# Altium schematic sheet LaserInterface.SchDoc
size A3
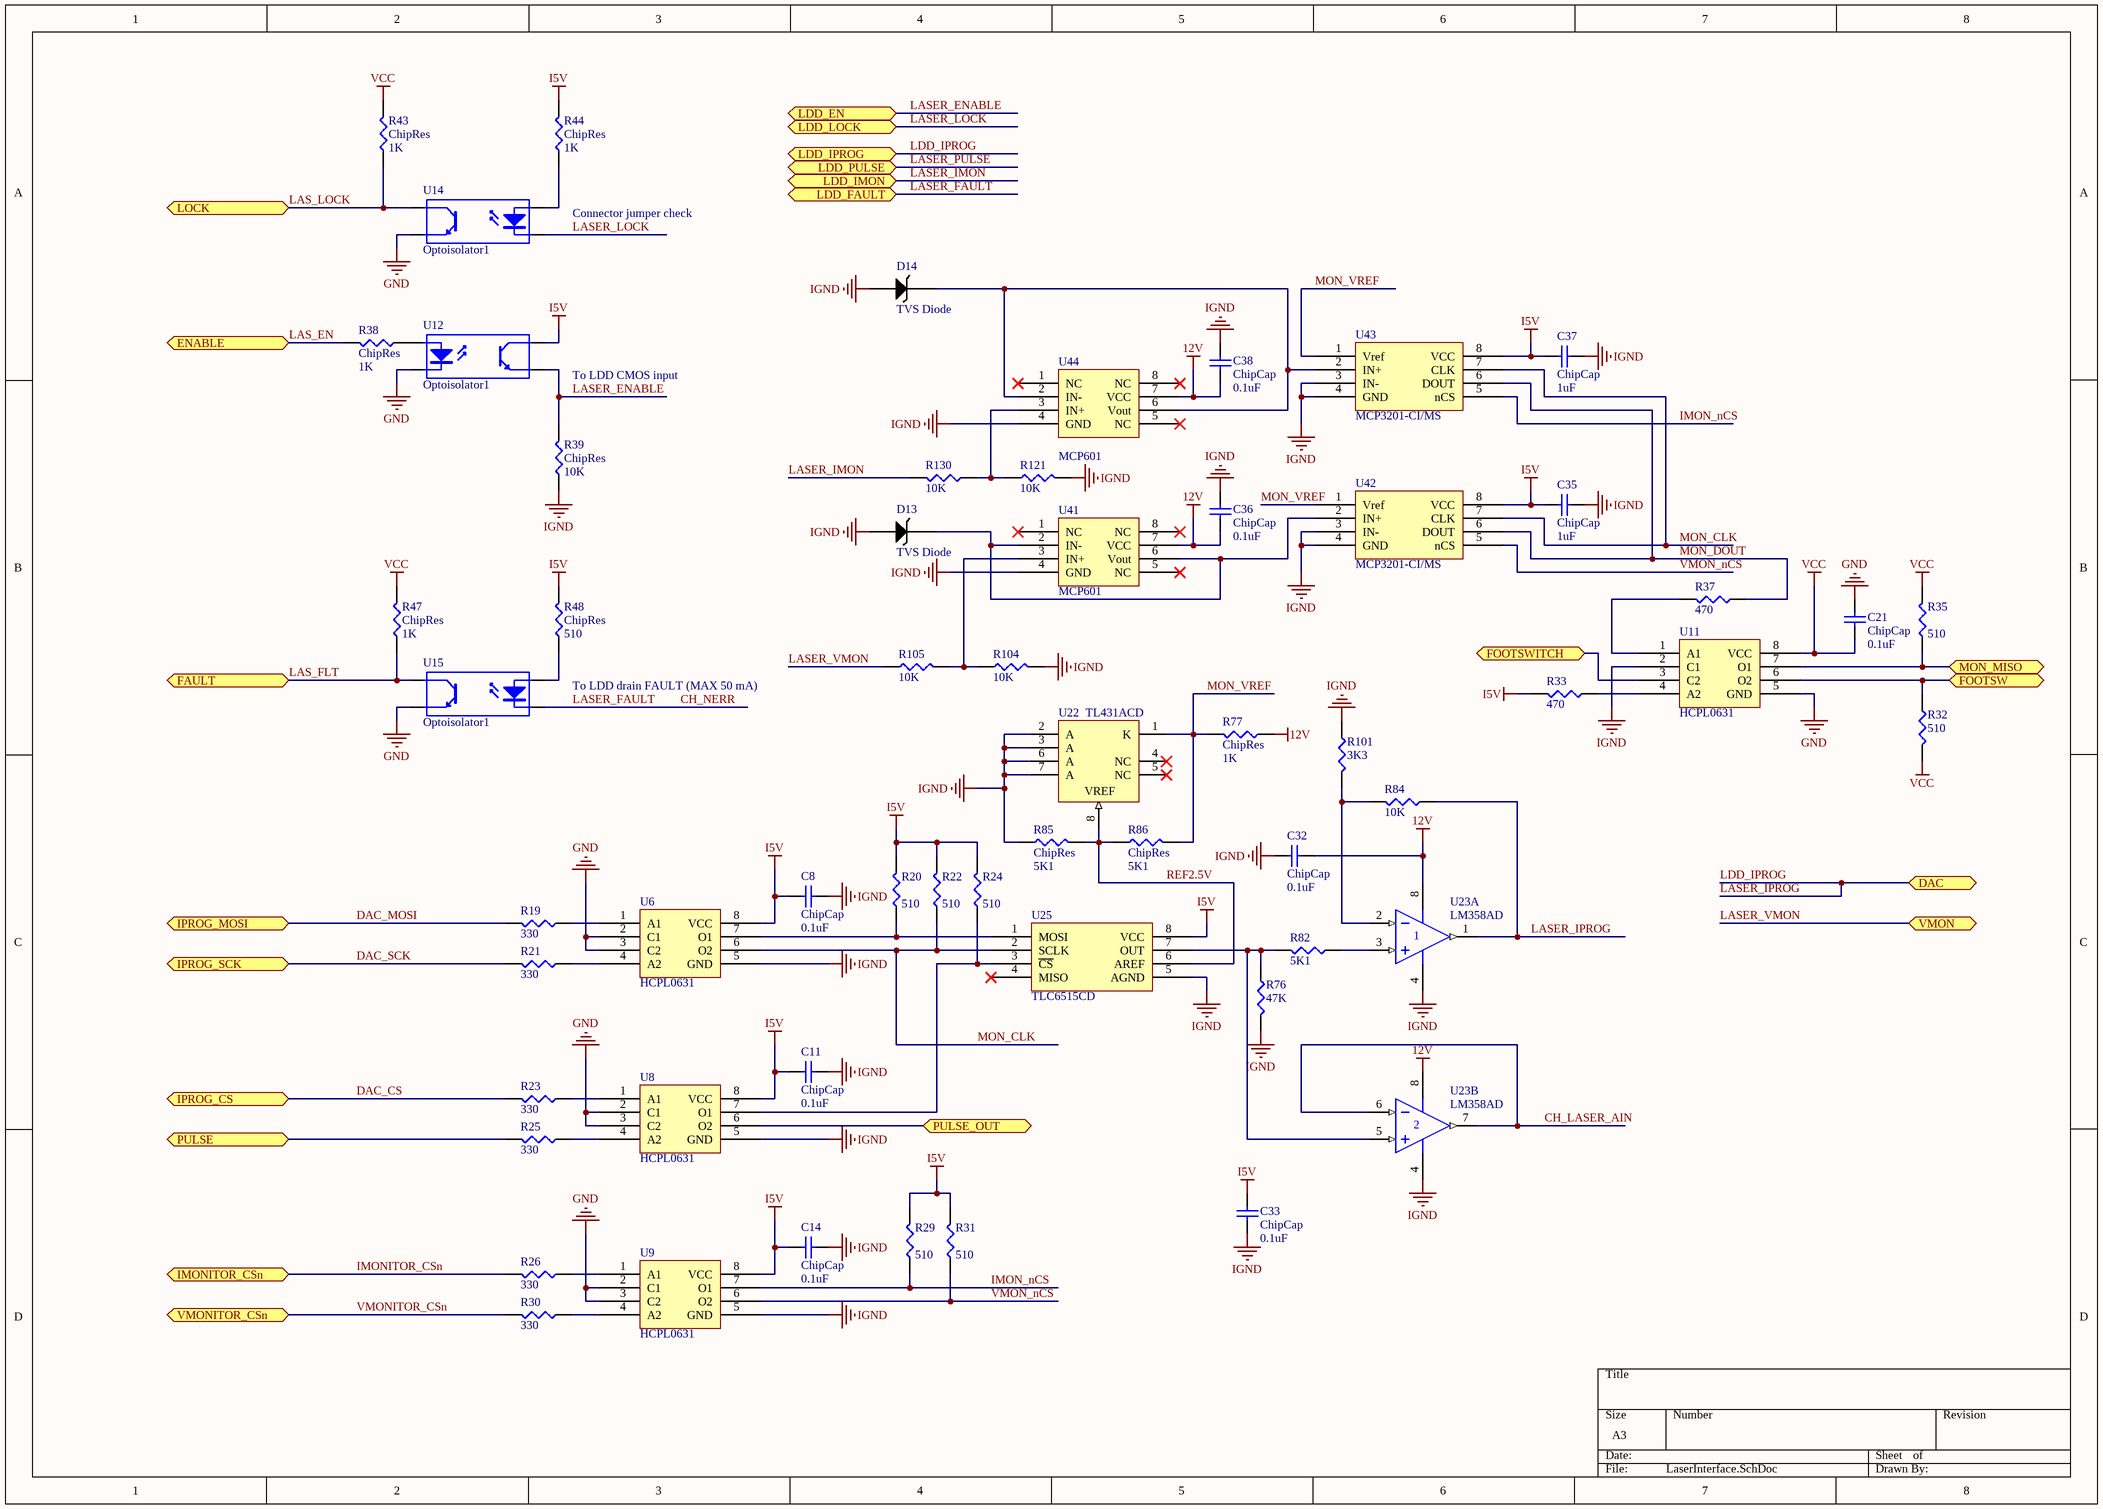
[diagram p0: LaserInterface.SchDoc]

## Parts
C8  ChipCap  value 0.1uF  [CAP0805]
C11  ChipCap  value 0.1uF  [CAP0805]
C14  ChipCap  value 0.1uF  [CAP0805]
C21  ChipCap  value 0.1uF  [CAP0805]
C32  ChipCap  value 0.1uF  [CAP0805]
C33  ChipCap  value 0.1uF  [CAP0805]
C35  ChipCap  value 1uF  [CAP0805]
C36  ChipCap  value 0.1uF  [CAP0805]
C37  ChipCap  value 1uF  [CAP0805]
C38  ChipCap  value 0.1uF  [CAP0805]
D13  TVS Diode  [DO-214AS]
D14  TVS Diode  [DO-214AS]
R19  value 330  [RES0805]  (hidden comment: ChipRes)
R20  value 510  [RES0805]  (hidden comment: ChipRes)
R21  value 330  [RES0805]  (hidden comment: ChipRes)
R22  value 510  [RES0805]  (hidden comment: ChipRes)
R23  value 330  [RES0805]  (hidden comment: ChipRes)
R24  value 510  [RES0805]  (hidden comment: ChipRes)
R25  value 330  [RES0805]  (hidden comment: ChipRes)
R26  value 330  [RES0805]  (hidden comment: ChipRes)
R29  value 510  [RES0805]  (hidden comment: ChipRes)
R30  value 330  [RES0805]  (hidden comment: ChipRes)
R31  value 510  [RES0805]  (hidden comment: ChipRes)
R32  value 510  [RES0805]  (hidden comment: ChipRes)
R33  value 470  [RES0805]  (hidden comment: ChipRes)
R35  value 510  [RES0805]  (hidden comment: ChipRes)
R37  value 470  [RES0805]  (hidden comment: ChipRes)
R38  ChipRes  value 1K  [RES0805]
R39  ChipRes  value 10K  [RES0805]
R43  ChipRes  value 1K  [RES0805]
R44  ChipRes  value 1K  [RES0805]
R47  ChipRes  value 1K  [RES0805]
R48  ChipRes  value 510  [RES0805]
R76  value 47K  [RES0805]  (hidden comment: ChipRes)
R77  ChipRes  value 1K  [RES0805]
R82  value 5K1  [RES0805]  (hidden comment: ChipRes)
R84  value 10K  [RES0805]  (hidden comment: ChipRes)
R85  ChipRes  value 5K1  [RES0805]
R86  ChipRes  value 5K1  [RES0805]
R101  value 3K3  [RES0805]  (hidden comment: ChipRes)
R104  value 10K  [RES0805]  (hidden comment: ChipRes)
R105  value 10K  [RES0805]  (hidden comment: ChipRes)
R121  value 10K  [RES0805]  (hidden comment: ChipRes)
R130  value 10K  [RES0805]  (hidden comment: ChipRes)
U6  HCPL0631  [SOIC8]
U8  HCPL0631  [SOIC8]
U9  HCPL0631  [SOIC8]
U11  HCPL0631  [SOIC8]
U12  Optoisolator1  [DIP-4]
U14  Optoisolator1  [DIP-4]
U15  Optoisolator1  [DIP-4]
U22  TL431ACD  [D008_N]
U23  LM358AD  [D008_L]  (parts A,B of 2)
U25  TLC6515CD  [SOIC8]
U41  MCP601  [SOIC8]
U42  MCP3201-CI/MS  [MSOP8]
U43  MCP3201-CI/MS  [MSOP8]
U44  MCP601  [SOIC8]

## Ports
DAC, ENABLE, FAULT, FOOTSW, FOOTSWITCH, IMONITOR_CSn, IPROG_CS, IPROG_MOSI, IPROG_SCK, LDD_EN, LDD_FAULT, LDD_IMON, LDD_IPROG, LDD_LOCK, LDD_PULSE, LOCK, MON_MISO, PULSE, PULSE_OUT, VMON, VMONITOR_CSn

## Nets
12V: C32.1 C36.2 C38.2 R77.1 U23.8(V+) U41.7(VCC) U44.7(VCC)
GND: C21.1 U6.2(C1) U6.3(C2) U8.2(C1) U8.3(C2) U9.2(C1) U9.3(C2) U11.5(GND) U12.2(K) U14.3(E) U15.3(E)
I5V: C8.2 C11.2 C14.2 C33.1 C35.2 C37.2 R20.2 R22.2 R24.2 R29.2 R31.2 R33.2 R44.2 R48.2 U6.8(VCC) U8.8(VCC) U9.8(VCC) U12.4(C) U25.8(VCC) U42.8(VCC) U43.8(VCC)
IGND: C8.1 C11.1 C14.1 C32.2 C33.2 C35.1 C36.1 C37.1 C38.1 D13.2 D14.2 R39.1 R76.2 R85.1 R101.1 R104.2 R121.2 U6.5(GND) U8.5(GND) U9.5(GND) U11.2(C1) U22.2(A) U22.3(A) U22.6(A) U22.7(A) U23.4(V-) U25.5(AGND) U41.4(GND) U42.3(IN-) U42.4(GND) U43.3(IN-) U43.4(GND) U44.4(GND)
VCC: C21.2 R32.2 R35.2 R43.2 R47.2 U11.8(VCC)
CH_LASER_AIN: U23.6(IN-) U23.7(OUT)
CH_NERR: U15.2(K) ; port LDD_FAULT  [also labelled LASER_FAULT]
DAC_CS: R23.2 ; port IPROG_CS
DAC_MOSI: R19.2 ; port IPROG_MOSI
DAC_SCK: R21.2 ; port IPROG_SCK
FOOTSW: R32.1 U11.6(O2) ; port FOOTSW
FOOTSWITCH: U11.3(C2) ; port FOOTSWITCH
IMON_nCS: R29.1 U9.7(O1) U43.5(nCS)
IMONITOR_CSn: R26.2 ; port IMONITOR_CSn
LAS_EN: R38.2 ; port ENABLE
LAS_FLT: R47.1 U15.4(C) ; port FAULT
LAS_LOCK: R43.1 U14.4(C) ; port LOCK
LASER_ENABLE: R39.2 U12.3(E) ; port LDD_EN
LASER_IMON: R130.2 ; port LDD_IMON
LASER_IPROG: R84.1 U23.1(OUT) ; port DAC, port LDD_IPROG  [also labelled LDD_IPROG]
LASER_LOCK: U14.2(K) ; port LDD_LOCK
LASER_PULSE: port LDD_PULSE
LASER_VMON: R105.1 ; port VMON
MON_CLK: R22.1 U6.6(O2) U25.2(SCLK) U42.7(CLK) U43.7(CLK)
MON_DOUT: R37.1 U42.6(DOUT) U43.6(DOUT)
MON_MISO: R35.1 U11.7(O1) ; port MON_MISO
MON_VREF: R77.2 R86.2 U22.1(K) U42.1(Vref) U43.1(Vref)
PULSE: R25.2 ; port PULSE
PULSE_OUT: U8.6(O2) ; port PULSE_OUT
REF2.5V: R85.2 R86.1 U22.8(VREF) U25.6(AREF)
VMON_nCS: R31.1 U9.6(O2) U42.5(nCS)
VMONITOR_CSn: R30.2 ; port VMONITOR_CSn
NetD13_1: D13.1 U41.2(IN-) U41.6(Vout) U42.2(IN+)
NetD14_1: D14.1 U43.2(IN+) U44.2(IN-) U44.6(Vout)
NetR19_1: R19.1 U6.1(A1)
NetR20_1: R20.1 U6.7(O1) U25.1(MOSI)
NetR21_1: R21.1 U6.4(A2)
NetR23_1: R23.1 U8.1(A1)
NetR24_1: R24.1 U8.7(O1) U25.3(~{CS})
NetR25_1: R25.1 U8.4(A2)
NetR26_1: R26.1 U9.1(A1)
NetR30_1: R30.1 U9.4(A2)
NetR33_1: R33.1 U11.4(A2)
NetR37_2: R37.2 U11.1(A1)
NetR38_1: R38.1 U12.1(A)
NetR44_1: R44.1 U14.1(A)
NetR48_1: R48.1 U15.1(A)
NetR76_1: R76.1 R82.2 U23.5(IN+) U25.7(OUT)
NetR82_1: R82.1 U23.3(IN+)
NetR84_2: R84.2 R101.2 U23.2(IN-)
NetR104_1: R104.1 R105.2 U41.3(IN+)
NetR121_1: R121.1 R130.1 U44.3(IN+)

Not connected (* = marked no-connect by the designer): U22 4(NC)* 5(NC)*; U25 4(MISO)*; U41 1(NC)* 5(NC)* 8(NC)*; U44 1(NC)* 5(NC)* 8(NC)*

## Notes on the sheet
- Connector jumper check
- To LDD CMOS input
- To LDD drain FAULT (MAX 50 mA)

## Library data of the parts
C8 C11 C14 C21 C32 C33 C35-C38 = ChipCap: Capacitor; Published: 8-Jun-2000; LatestRevisionDate: 17-Jul-2002; LatestRevisionNote: Re-released for DXP Platform.; PackageReference: RAD-0.3; Publisher: Altium Limited
D13 D14 = TVS Diode SMA
R19-R26 R29-R33 R35 R37-R39 R43 R44 R47 R48 R76 R77 R82 R84-R86 R101 R104 R105 R121 R130 = ChipRes: Chip resistor
U6 U8 U9 U11 = HCPL0631: 2-channel opto-coupler
U12 U14 U15 = Optoisolator1: 4-Pin Phototransistor Optocoupler; Published: 24-Mar-1999; LatestRevisionDate: 04-Mar-2005; LatestRevisionNote: Sch pins 3 & 4 Swapped.; DatasheetVersion: Nov-2003; PackageReference: DIP-4; Publisher: Altium Limited
U22 = TL431ACD: Adjustable Precision Shunt Regulator; Published: 15-Apr-2002; LatestRevisionDate: 13-Apr-2006; LatestRevisionNote: IPC-7351 Footprint Added.; DatasheetVersion: Oct-2000; PackageVersion: Jan-1998; PackageReference: D008; Publisher: Altium Limited; PackageDescription: 8-Pin Small Outline Integrated Circuit 1.27 mm Pitch; Code_IPC: SOIC127P600-8; ComponentLink1Description: Manufacturer Link; ComponentLink1URL: http://www.ti.com/; ComponentLink2Description: Datasheet; ComponentLink2URL: http://www-s.ti.com/sc/ds/tl431a.pdf
U23 = LM358AD: Dual Operational Amplifier; Published: 15-Apr-2002; LatestRevisionDate: 13-Apr-2006; LatestRevisionNote: IPC-7351 Footprint Added.; DatasheetVersion: Aug-1988; PackageVersion: Jan-1998; PackageReference: D008; Publisher: Altium Limited; PackageDescription: 8-Pin Small Outline Integrated Circuit 1.27 mm Pitch; Code_IPC: SOIC127P600-8; ComponentLink1Description: Manufacturer Link; ComponentLink1URL: http://www.ti.com/; ComponentLink2Description: Datasheet; ComponentLink2URL: http://www-s.ti.com/sc/ds/lm358.pdf
U25 = TLC6515: 10-bit analog to digiyal converter; Manufacturer: Texas Instruments
U41 U44 = MCP601: Operational Amplifier
U42 U43 = MCP3201-CI/MS: SAR 12-bit Analog-to-Digital  (A/D); Manufacturer: Microchip; Maximum Sampling Rate: 100 ksps; Supplier 1: Platan; Supplier 2: Terraelectronica; ComponentLink1Description: Datasheet; ComponentLink1URL: http://www.farnell.com/datasheets/1669366.pdf; Supplier Part Number 1: 200659200; Supplier Part Number 2: 181061